# EasyEDA schematic SCH_Reserach-project_2025-06-22.json

## Sheets
1 Sheet_1: TITLE: Sheet_1; REV: 1.0; Date: 2025-05-27; Sheet: 1/1; Drawn By: nvasyliev; Company: Your Company
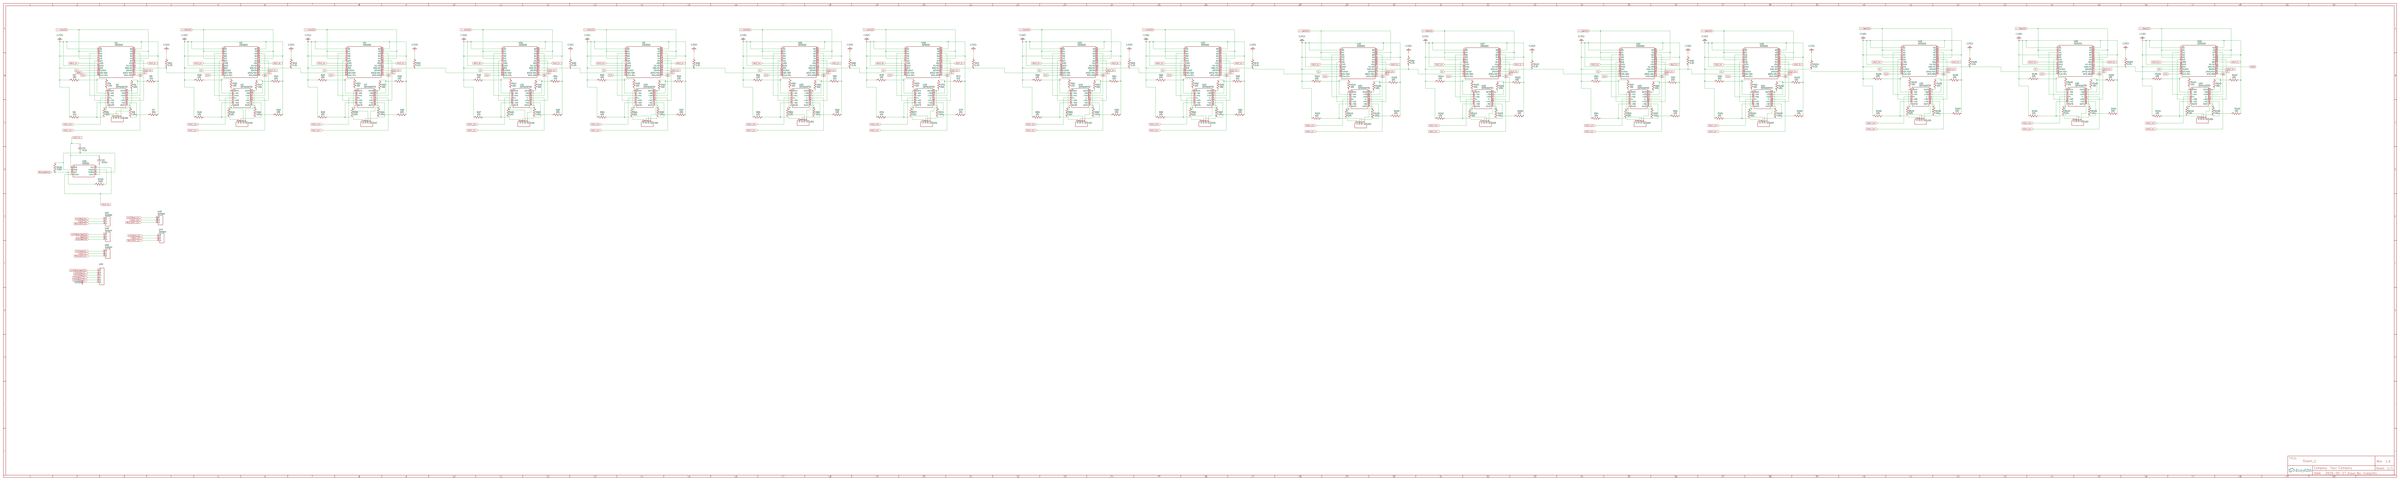
[diagram p0: Sheet_1]
2 Sheet_2: TITLE: Sheet_2; Date: 2025-05-30
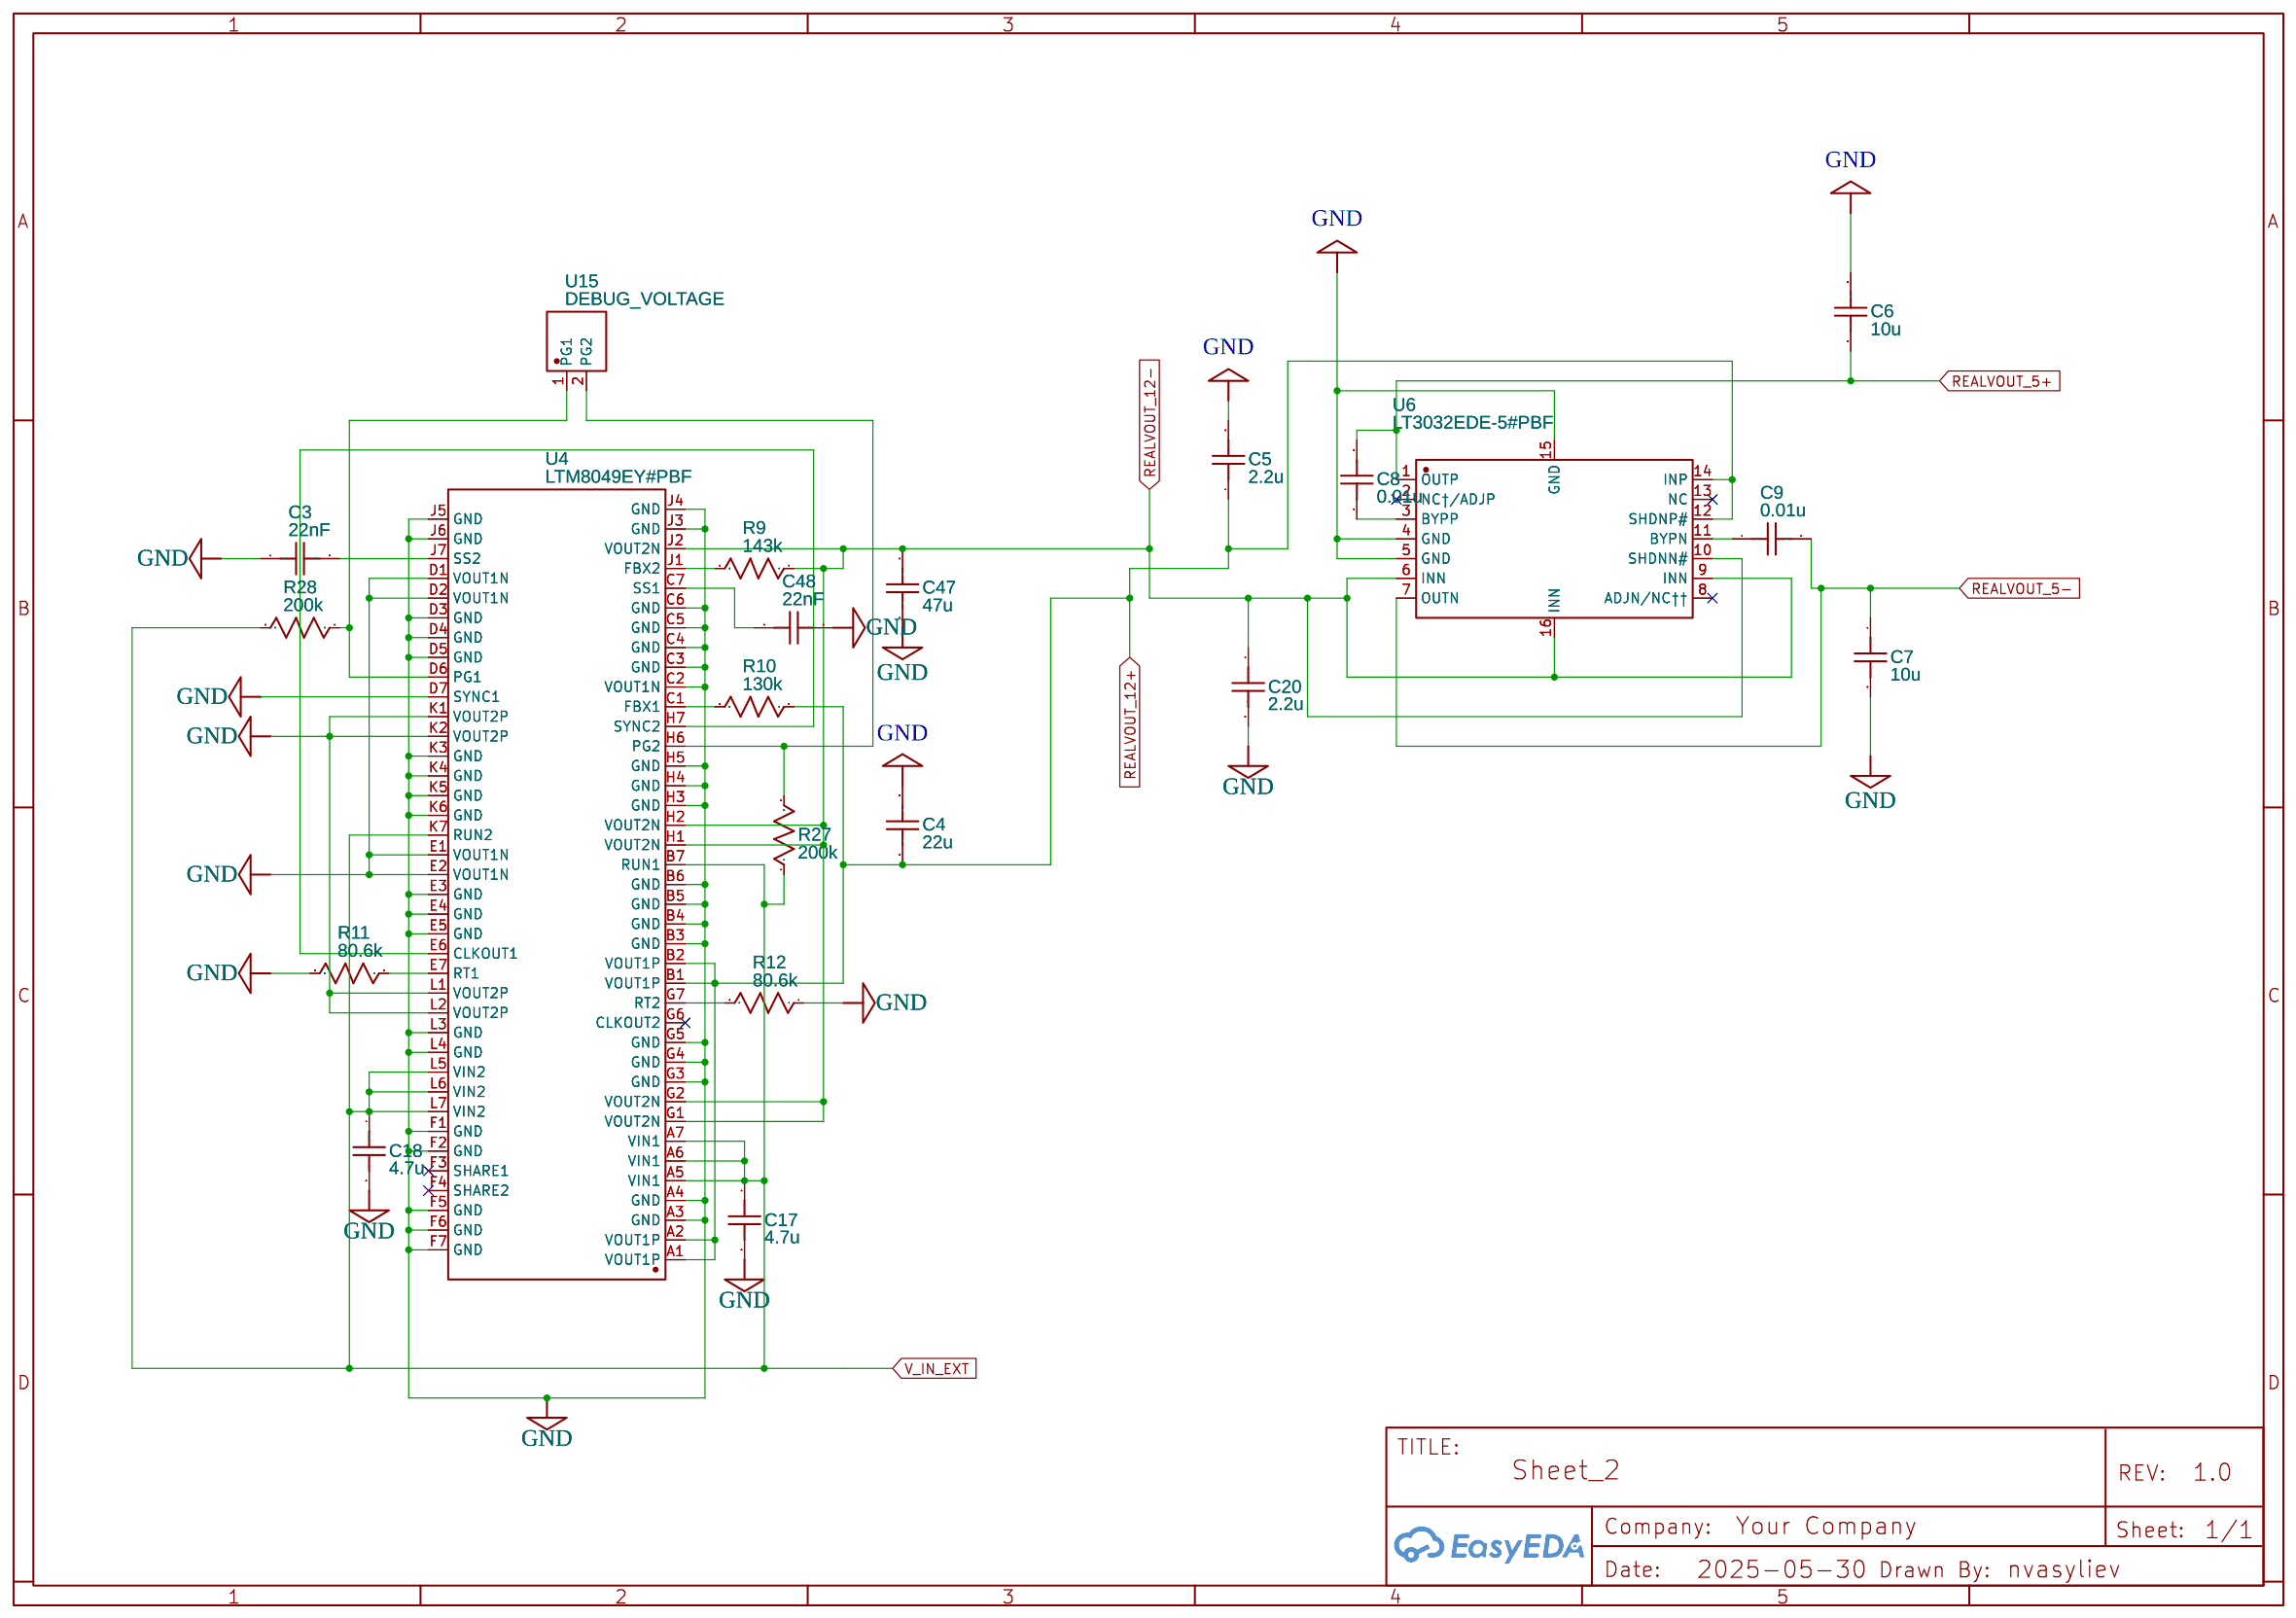
[diagram p1: Sheet_2]
3 Sheet_3: TITLE: Sheet_3; Date: 2025-05-30
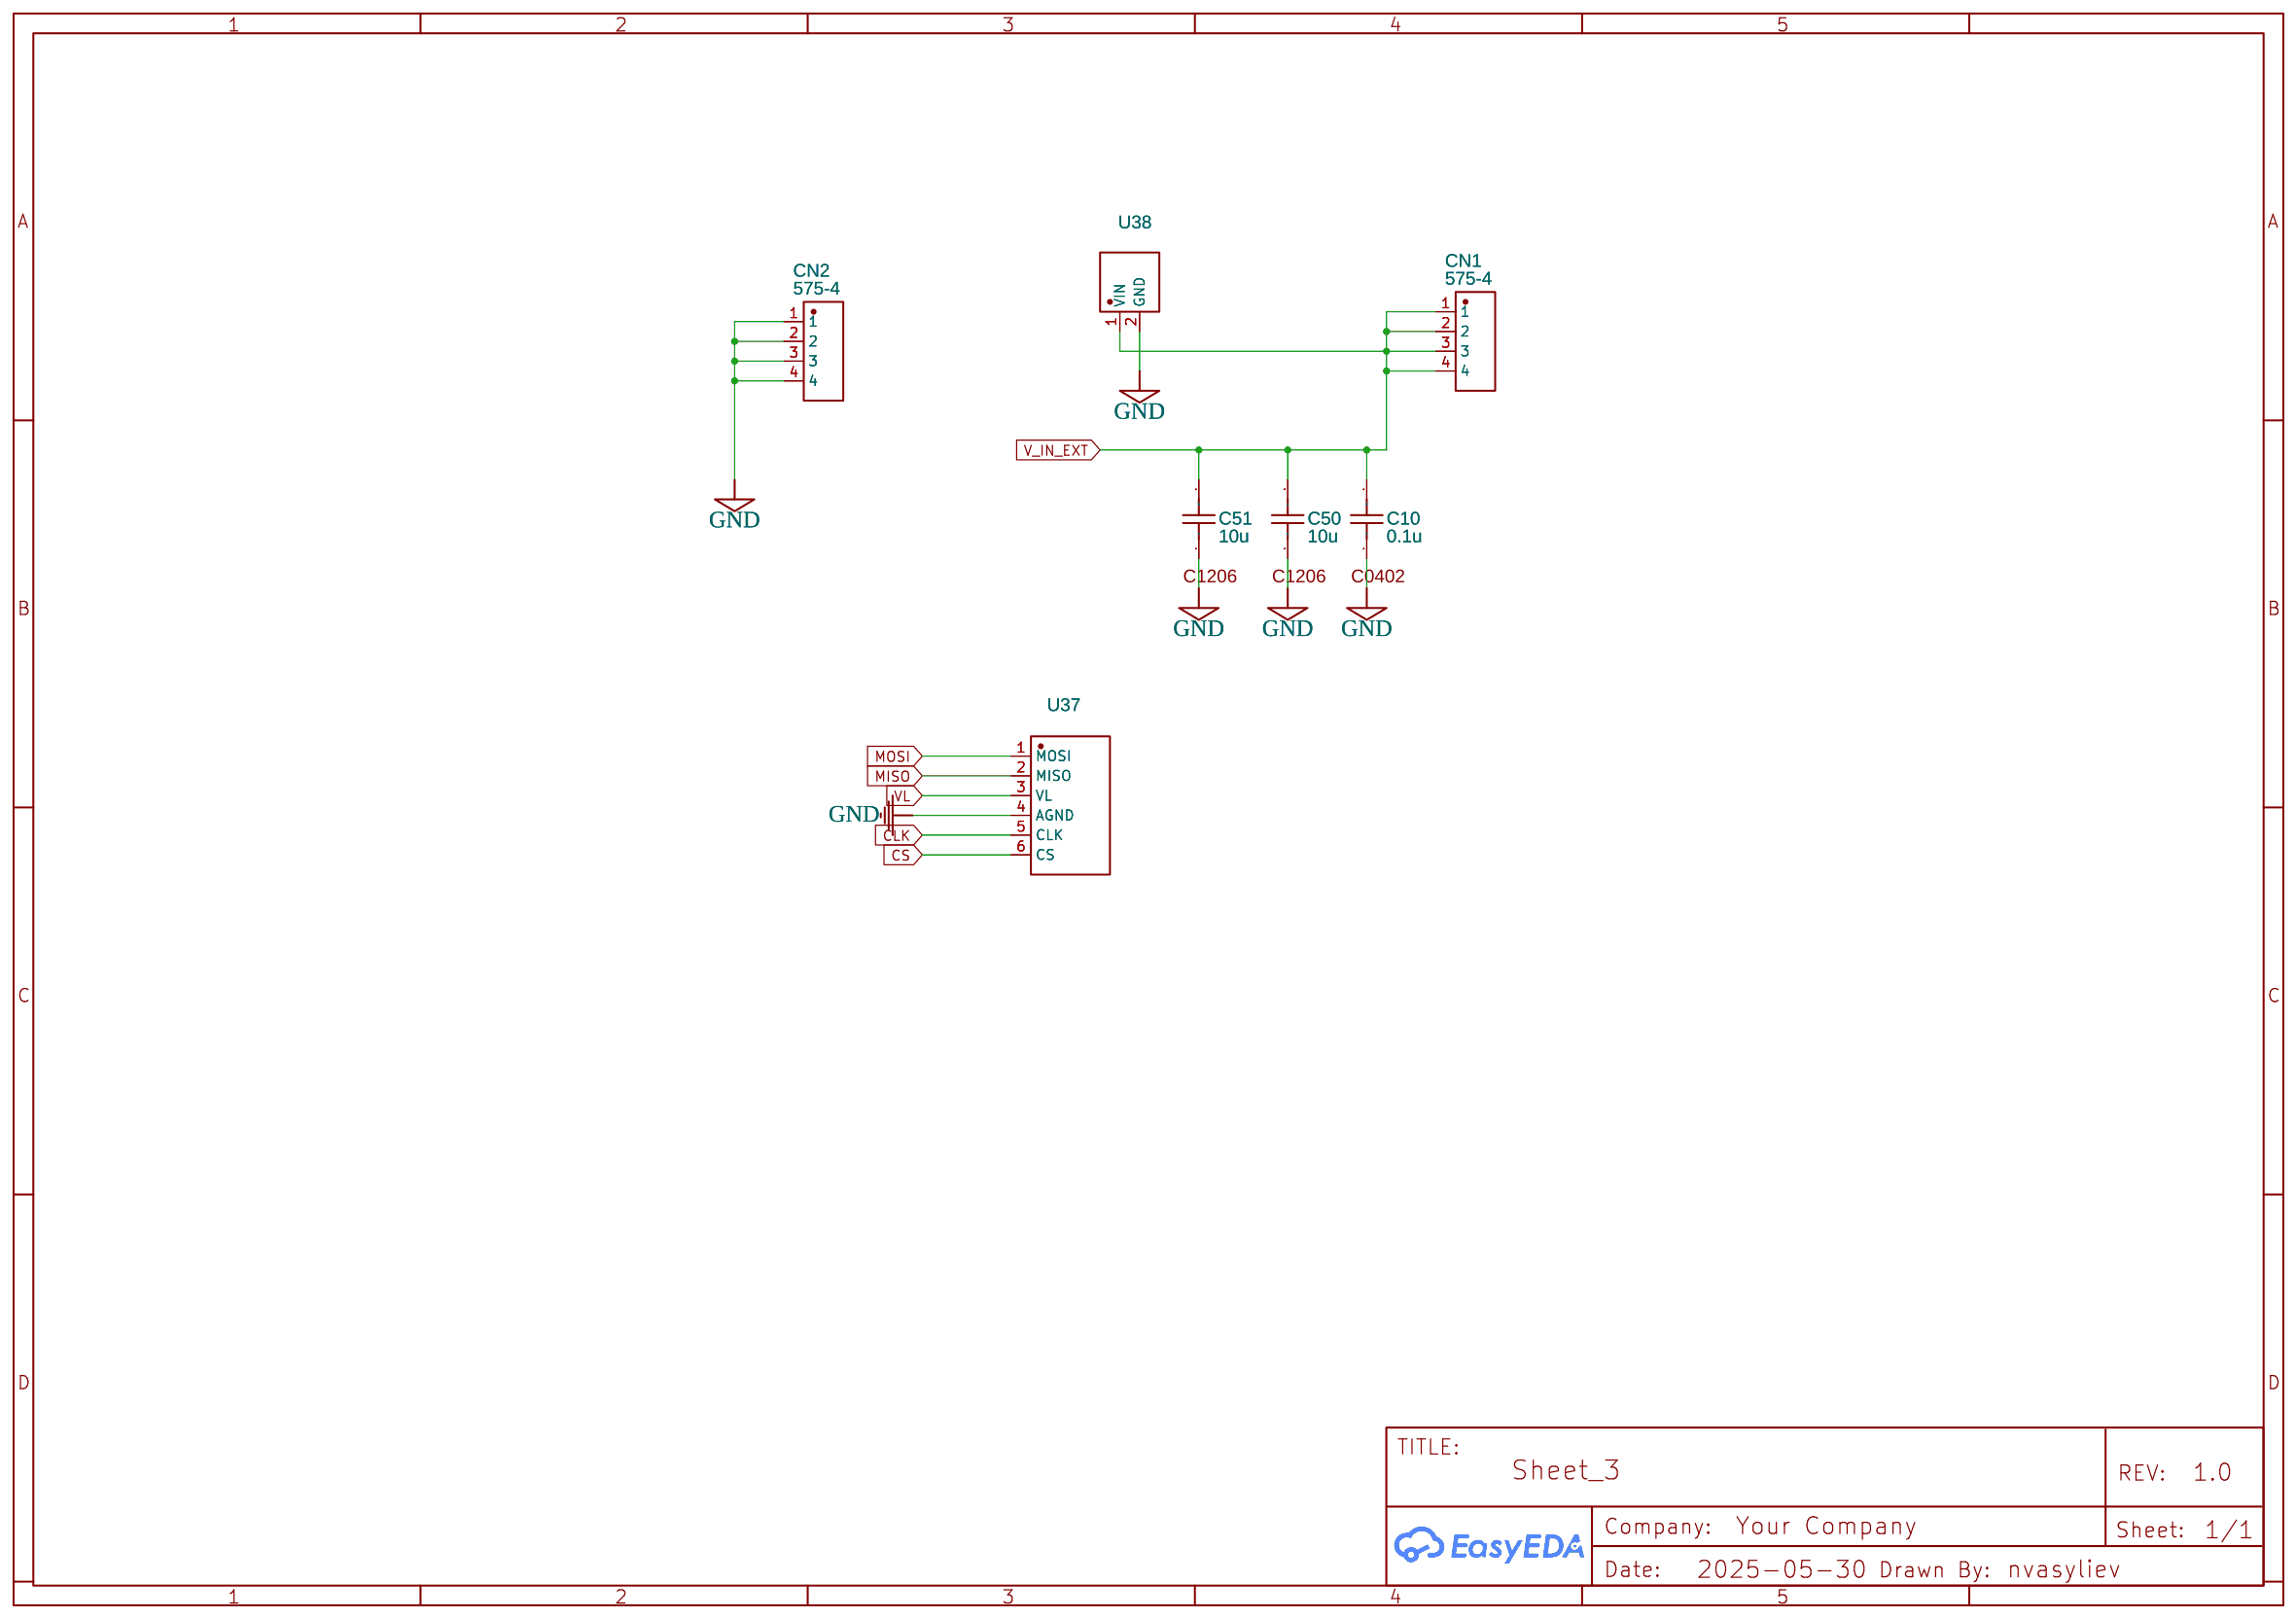
[diagram p2: Sheet_3]

## Parts
sheet Sheet_1
C1  0.1u  [C0603]
C2  0.01u  [C0603]
R1  10k  [R0603]
R2  10k  [R0603]
R3  10k  [R0603]
R4  10k  [R0603]
R5  10k  [R0603]
R6  10k  [R0603]
R7  10k  [R0603]
R8  10k  [R0603]
R13  2.2k  [R0603]
R14  10k  [R0603]
R15  10k  [R0603]
R16  10k  [R0603]
R17  10k  [R0603]
R18  10k  [R0603]
R19  10k  [R0603]
R20  10k  [R0603]
R21  2.2k  [R0603]
R22  10k  [R0603]
R23  10k  [R0603]
R24  10k  [R0603]
R25  10k  [R0603]
R26  2.2k  [R0603]
R29  10k  [R0603]
R30  10k  [R0603]
R31  10k  [R0603]
R32  10k  [R0603]
R33  10k  [R0603]
R34  2.2k  [R0603]
R35  2.2k  [R0603]
R36  10k  [R0603]
R37  10k  [R0603]
R38  10k  [R0603]
R39  10k  [R0603]
R40  10k  [R0603]
R41  10k  [R0603]
R42  10k  [R0603]
R43  10k  [R0603]
R44  10k  [R0603]
R45  10k  [R0603]
R46  10k  [R0603]
R47  10k  [R0603]
R48  10k  [R0603]
R49  10k  [R0603]
R50  10k  [R0603]
R51  10k  [R0603]
R52  2.2k  [R0603]
R53  2.2k  [R0603]
R54  10k  [R0603]
R55  10k  [R0603]
R56  10k  [R0603]
R57  10k  [R0603]
R58  10k  [R0603]
R59  10k  [R0603]
R60  10k  [R0603]
R61  10k  [R0603]
R62  10k  [R0603]
R63  10k  [R0603]
R64  10k  [R0603]
R65  10k  [R0603]
R66  10k  [R0603]
R67  10k  [R0603]
R68  10k  [R0603]
R69  10k  [R0603]
R70  2.2k  [R0603]
R71  2.2k  [R0603]
R72  10k  [R0603]
R73  10k  [R0603]
R74  10k  [R0603]
R75  10k  [R0603]
R76  10k  [R0603]
R77  10k  [R0603]
R78  10k  [R0603]
R79  10k  [R0603]
R80  10k  [R0603]
R81  10k  [R0603]
R82  10k  [R0603]
R83  10k  [R0603]
R84  10k  [R0603]
R85  10k  [R0603]
R86  10k  [R0603]
R87  10k  [R0603]
R88  2.2k  [R0603]
R89  2.2k  [R0603]
R90  10k  [R0603]
R91  10k  [R0603]
R92  10k  [R0603]
R93  10k  [R0603]
R94  10k  [R0603]
R95  10k  [R0603]
R96  10k  [R0603]
R97  10k  [R0603]
R98  10k  [R0603]
R99  10k  [R0603]
R100  10k  [R0603]
R101  10k  [R0603]
R102  10k  [R0603]
R103  10k  [R0603]
R104  10k  [R0603]
R105  10k  [R0603]
R106  2.2k  [R0603]
R107  2.2k  [R0603]
R108  10k  [R0603]
R109  10k  [R0603]
R110  10k  [R0603]
R111  10k  [R0603]
R112  10k  [R0603]
R113  10k  [R0603]
R114  10k  [R0603]
R115  10k  [R0603]
R116  10k  [R0603]
R117  10k  [R0603]
R118  10k  [R0603]
R119  10k  [R0603]
R120  10k  [R0603]
R121  10k  [R0603]
R122  10k  [R0603]
R123  10k  [R0603]
R125  10k  [R0603]
R126  10k  [R0603]
R127  10k  [R0603]
R128  10k  [R0603]
R129  7150  [R0603]
R130  7150  [R0603]
R131  10k  [R0603]
R132  10k  [R0603]
R133  10k  [R0603]
R134  10k  [R0603]
R135  2.2k  [R0603]
R137  10k  [R0603]
R138  10k  [R0603]
R139  10k  [R0603]
R140  10k  [R0603]
R141  10k  [R0603]
R142  10k  [R0603]
R143  10k  [R0603]
R144  10k  [R0603]
R145  10k  [R0603]
R146  10k  [R0603]
R147  10k  [R0603]
R148  10k  [R0603]
R149  10k  [R0603]
R150  10k  [R0603]
R151  10k  [R0603]
R152  10k  [R0603]
R153  2.2k  [R0603]
U1  AD5263  [TSSOP-24_L7.8-W4.4-P0.65-LS6.4-TL]
U2  OPA4197ID  [SOIC-14_L8.7-W3.9-P1.27-LS6.0-BL]
U3  AD5263  [TSSOP-24_L7.8-W4.4-P0.65-LS6.4-TL]
U5  OPA4197ID  [SOIC-14_L8.7-W3.9-P1.27-LS6.0-BL]
U7  OPA4197ID  [SOIC-14_L8.7-W3.9-P1.27-LS6.0-BL]
U8  AD5263  [TSSOP-24_L7.8-W4.4-P0.65-LS6.4-TL]
U9  AD5263  [TSSOP-24_L7.8-W4.4-P0.65-LS6.4-TL]
U10  OPA4197ID  [SOIC-14_L8.7-W3.9-P1.27-LS6.0-BL]
U11  OPA4197ID  [SOIC-14_L8.7-W3.9-P1.27-LS6.0-BL]
U12  AD5263  [TSSOP-24_L7.8-W4.4-P0.65-LS6.4-TL]
U13  AD5263  [TSSOP-24_L7.8-W4.4-P0.65-LS6.4-TL]
U14  OPA4197ID  [SOIC-14_L8.7-W3.9-P1.27-LS6.0-BL]
U16  OPA4197ID  [SOIC-14_L8.7-W3.9-P1.27-LS6.0-BL]
U17  AD5263  [TSSOP-24_L7.8-W4.4-P0.65-LS6.4-TL]
U18  AD5263  [TSSOP-24_L7.8-W4.4-P0.65-LS6.4-TL]
U19  OPA4197ID  [SOIC-14_L8.7-W3.9-P1.27-LS6.0-BL]
U20  OPA4197ID  [SOIC-14_L8.7-W3.9-P1.27-LS6.0-BL]
U21  AD5263  [TSSOP-24_L7.8-W4.4-P0.65-LS6.4-TL]
U22  AD5263  [TSSOP-24_L7.8-W4.4-P0.65-LS6.4-TL]
U23  OPA4197ID  [SOIC-14_L8.7-W3.9-P1.27-LS6.0-BL]
U24  OPA4197ID  [SOIC-14_L8.7-W3.9-P1.27-LS6.0-BL]
U25  NE555  [SOP-8_L5.0-W4.0-P1.27-LS6.0-BL]
U26  AD5263  [TSSOP-24_L7.8-W4.4-P0.65-LS6.4-TL]
U27  AD5263  [TSSOP-24_L7.8-W4.4-P0.65-LS6.4-TL]
U28  OPA4197ID  [SOIC-14_L8.7-W3.9-P1.27-LS6.0-BL]
U29  OPA4197ID  [SOIC-14_L8.7-W3.9-P1.27-LS6.0-BL]
U30  AD5263  [TSSOP-24_L7.8-W4.4-P0.65-LS6.4-TL]
U31  OPA4197ID  [SOIC-14_L8.7-W3.9-P1.27-LS6.0-BL]
U32  AD5263  [TSSOP-24_L7.8-W4.4-P0.65-LS6.4-TL]
U33  AD5263  [TSSOP-24_L7.8-W4.4-P0.65-LS6.4-TL]
U34  OPA4197ID  [SOIC-14_L8.7-W3.9-P1.27-LS6.0-BL]
U35  OPA4197ID  [SOIC-14_L8.7-W3.9-P1.27-LS6.0-BL]
U36  AD5263  [TSSOP-24_L7.8-W4.4-P0.65-LS6.4-TL]
U39  NO  [4-CONNECTOR]
U40  Jumper  [3-CONNECTOR]
U41  Jumper  [3-CONNECTOR]
U42  Jumper  [3-CONNECTOR]
U43  Jumper  [3-CONNECTOR]
U44  Jumper  [3-CONNECTOR]
U45  NO  [6-CONNECTOR]
U46  NO  [4-CONNECTOR]
U47  NO  [4-CONNECTOR]
U48  NO  [4-CONNECTOR]
U49  NO  [4-CONNECTOR]
U50  NO  [4-CONNECTOR]
U51  NO  [4-CONNECTOR]
U52  NO  [4-CONNECTOR]
U53  NO  [4-CONNECTOR]
U54  NO  [4-CONNECTOR]
U55  NO  [4-CONNECTOR]
U56  NO  [4-CONNECTOR]
U57  NO  [4-CONNECTOR]
U58  NO  [4-CONNECTOR]
U59  NO  [4-CONNECTOR]
U60  NO  [4-CONNECTOR]
sheet Sheet_2
C3  22nF  [C0603]
C4  22u  [C1210]
C5  2.2u  [C0805]
C6  10u  [C1206]
C7  10u  [C1206]
C8  0.01u  [C0402]
C9  0.01u  [C0402]
C17  4.7u  [C0603]
C18  4.7u  [C0603]
C20  2.2u  [C0805]
C47  47u  [C1210]
C48  22nF  [C0603]
R9  143k  [R0603]
R10  130k  [R0603]
R11  80.6k  [R0603]
R12  80.6k  [R0603]
R27  200k  [R0603]
R28  200k  [R0603]
U4  LTM8049EY#PBF  [BGA-77_L15.0-W9.0-R11-C7-P1.27-TL]
U6  LT3032EDE-5#PBF  [DFN-14_L4.0-W3.0-P0.50-BL-EP_LT3032XXX]
U15  DEBUG_VOLTAGE  [2-CONNECTOR]
sheet Sheet_3
C10  0.1u  [C0402]
C50  10u  [C1206]
C51  10u  [C1206]
CN1  575-4  [SMD_BD7.9-L7.9-W7.9-D5.2]
CN2  575-4  [SMD_BD7.9-L7.9-W7.9-D5.2]
U37  -  [6-CONNECTOR]
U38  -  [2-CONNECTOR]

## Library data of the parts
C1 C2 C6-C9 C17 C18 = C_0603_US: Contributor: LCEDA_Lib
R1-R123 R125-R135 R137-R153 = R_0603_US: Contributor: LCEDA_Lib
U1 U3 U8 U9 U12 U13 U17 U18 U21 U22 U26 U27 U30 U32 U33 U36 = AD5263BRUZ20: Contributor: LCSC; Supplier: LCSC; Supplier Part: C207963; Manufacturer: ADI(亚德诺); JLCPCB Part Class: Extended Part
U2 U5 U7 U10 U11 U14 U16 U19 U20 U23 U24 U28 U29 U31 U34 U35 = OPA4197ID: Contributor: LCSC; Supplier: LCSC; Supplier Part: C2872557; Manufacturer: TI(德州仪器); JLCPCB Part Class: Extended Part
U25 = NE555: Contributor: LCSC; Supplier: LCSC; Supplier Part: C504549; Manufacturer: null; JLCPCB Part Class: Extended Part
C3 C4 C47 C48 = C_1206_US: Contributor: LCEDA_Lib
C5 C20 = C_0603_US: Contributor: LCEDA_Lib; Package Display: No
U4 = LTM8049EY#PBF: Contributor: LCSC; Supplier: LCSC; Supplier Part: C690701; Manufacturer: ADI(亚德诺); JLCPCB Part Class: Extended Part
U6 = LT3032EDE-5#PBF: Contributor: LCSC; Supplier: LCSC; Supplier Part: C580007; Manufacturer: ADI(亚德诺); JLCPCB Part Class: Extended Part
U15 = DEBUG_VOLTAGE
C10 C50 C51 = C_0603_US: Contributor: LCEDA_Lib; Package Display: Yes
CN1 CN2 = 575-4: Supplier: LCSC; Supplier Part: C4944061; Manufacturer: Keystone; JLCPCB Part Class: Extended Part; Contributor: lcsc

## Nets
GND: C3.1 C4.2 C5.2 C6.2 C7.2 C10.1 C17.2 C18.2 C20.2 C47.1 C48.2 C50.1 C51.1 CN2.1 CN2.2 CN2.3 CN2.4 R2.1 R4.1 R7.2 R8.2 R11.2 R12.1 R13.2 R14.2 R15.2 R18.1 R20.1 R21.2 R24.1 R26.2 R29.1 R32.2 R33.2 R34.2 R35.2 R36.2 R37.2 R40.1 R42.1 R45.1 R47.1 R50.2 R51.2 R52.2 R53.2 R54.2 R55.2 R58.1 R60.1 R63.1 R65.1 R68.2 R69.2 R70.2 R71.2 R72.2 R73.2 R76.1 R78.1 R81.1 R83.1 R86.2 R87.2 R88.2 R89.2 R90.2 R91.2 R94.1 R96.1 R99.1 R101.1 R104.2 R105.2 R106.2 R107.2 R108.2 R109.2 R112.1 R114.1 R117.1 R119.1 R122.2 R123.2 R126.1 R128.1 R133.2 R134.2 R135.2 R137.2 R138.2 R141.1 R143.1 R146.1 R148.1 R151.2 R152.2 R153.2 U1.1(B1) U1.4(B3) U1.8(GND) U1.9(DIS) U1.21(B4) U1.24(B2) U3.1(B1) U3.4(B3) U3.8(GND) U3.9(DIS) U3.21(B4) U3.24(B2) U4.A3(GND) U4.A4(GND) U4.B3(GND) U4.B4(GND) U4.B5(GND) U4.B6(GND) U4.C2(VOUT1N) U4.C3(GND) U4.C4(GND) U4.C5(GND) U4.C6(GND) U4.D1(VOUT1N) U4.D2(VOUT1N) U4.D3(GND) U4.D4(GND) U4.D5(GND) U4.D7(SYNC1) U4.E1(VOUT1N) U4.E2(VOUT1N) U4.E3(GND) U4.E4(GND) U4.E5(GND) U4.F1(GND) U4.F2(GND) U4.F5(GND) U4.F6(GND) U4.F7(GND) U4.G3(GND) U4.G4(GND) U4.G5(GND) U4.H3(GND) U4.H4(GND) U4.H5(GND) U4.J3(GND) U4.J4(GND) U4.J5(GND) U4.J6(GND) U4.K1(VOUT2P) U4.K2(VOUT2P) U4.K3(GND) U4.K4(GND) U4.K5(GND) U4.K6(GND) U4.L1(VOUT2P) U4.L2(VOUT2P) U4.L3(GND) U4.L4(GND) U6.4(GND) U6.5(GND) U6.15(GND) U8.1(B1) U8.4(B3) U8.8(GND) U8.9(DIS) U8.21(B4) U8.24(B2) U9.1(B1) U9.4(B3) U9.8(GND) U9.9(DIS) U9.21(B4) U9.24(B2) U12.1(B1) U12.4(B3) U12.8(GND) U12.9(DIS) U12.21(B4) U12.24(B2) U13.1(B1) U13.4(B3) U13.8(GND) U13.9(DIS) U13.21(B4) U13.24(B2) U17.1(B1) U17.4(B3) U17.8(GND) U17.9(DIS) U17.21(B4) U17.24(B2) U18.1(B1) U18.4(B3) U18.8(GND) U18.9(DIS) U18.21(B4) U18.24(B2) U21.1(B1) U21.4(B3) U21.8(GND) U21.9(DIS) U21.21(B4) U21.24(B2) U22.1(B1) U22.4(B3) U22.8(GND) U22.9(DIS) U22.21(B4) U22.24(B2) U26.1(B1) U26.4(B3) U26.8(GND) U26.9(DIS) U26.21(B4) U26.24(B2) U27.1(B1) U27.4(B3) U27.8(GND) U27.9(DIS) U27.21(B4) U27.24(B2) U30.1(B1) U30.4(B3) U30.8(GND) U30.9(DIS) U30.21(B4) U30.24(B2) U32.1(B1) U32.4(B3) U32.8(GND) U32.9(DIS) U32.21(B4) U32.24(B2) U33.1(B1) U33.4(B3) U33.8(GND) U33.9(DIS) U33.21(B4) U33.24(B2) U36.1(B1) U36.4(B3) U36.8(GND) U36.9(DIS) U36.21(B4) U36.24(B2) U37.4(AGND) U38.2(GND) U45.6
+-5WAVES: U1.2(A1) U1.5(A3) U1.20(A4) U1.23(A2) U3.2(A1) U3.5(A3) U3.20(A4) U3.23(A2) U8.2(A1) U8.5(A3) U8.20(A4) U8.23(A2) U9.2(A1) U9.5(A3) U9.20(A4) U9.23(A2) U12.2(A1) U12.5(A3) U12.20(A4) U12.23(A2) U13.2(A1) U13.5(A3) U13.20(A4) U13.23(A2) U17.2(A1) U17.5(A3) U17.20(A4) U17.23(A2) U18.2(A1) U18.5(A3) U18.20(A4) U18.23(A2) U21.2(A1) U21.5(A3) U21.20(A4) U21.23(A2) U22.2(A1) U22.5(A3) U22.20(A4) U22.23(A2) U26.2(A1) U26.5(A3) U26.20(A4) U26.23(A2) U27.2(A1) U27.5(A3) U27.20(A4) U27.23(A2) U30.2(A1) U30.5(A3) U30.20(A4) U30.23(A2) U32.2(A1) U32.5(A3) U32.20(A4) U32.23(A2) U33.2(A1) U33.5(A3) U33.20(A4) U33.23(A2) U36.2(A1) U36.5(A3) U36.20(A4) U36.23(A2) U40.2
CLK: U1.12(CLK/SCL) U3.12(CLK/SCL) U8.12(CLK/SCL) U9.12(CLK/SCL) U12.12(CLK/SCL) U13.12(CLK/SCL) U17.12(CLK/SCL) U18.12(CLK/SCL) U21.12(CLK/SCL) U22.12(CLK/SCL) U26.12(CLK/SCL) U27.12(CLK/SCL) U30.12(CLK/SCL) U32.12(CLK/SCL) U33.12(CLK/SCL) U36.12(CLK/SCL) U37.5(CLK)
CS: U1.13(#CS/AD0) U3.13(#CS/AD0) U8.13(#CS/AD0) U9.13(#CS/AD0) U12.13(#CS/AD0) U13.13(#CS/AD0) U17.13(#CS/AD0) U18.13(#CS/AD0) U21.13(#CS/AD0) U22.13(#CS/AD0) U26.13(#CS/AD0) U27.13(#CS/AD0) U30.13(#CS/AD0) U32.13(#CS/AD0) U33.13(#CS/AD0) U36.13(#CS/AD0) U37.6(CS)
EXTERNAL5+: U41.1 U45.3
EXTERNAL5-: U42.1 U45.2
EXTERNAL5WAVES: U40.1 U45.1
EXTERNAL12+: U43.1 U45.5
EXTERNAL12-: U44.1 U45.4
MISO: U33.16(SDO/O1) U37.2(MISO)
MOSI: U1.11(SDI/SDA) U37.1(MOSI)
REAL5WAVES: R129.1 R130.1 U25.3(OUT) U40.3
REALVOUT_5+: C6.1 C8.2 U6.1(OUTP) U41.3
REALVOUT_5-: C7.1 C9.2 U6.7(OUTN) U42.3
REALVOUT_12+: C4.1 C5.1 R10.1 U4.A1(VOUT1P) U4.A2(VOUT1P) U4.B1(VOUT1P) U4.B2(VOUT1P) U6.12(SHDNP#) U6.14(INP) U43.3
REALVOUT_12-: C20.1 C47.2 R9.1 U4.G1(VOUT2N) U4.G2(VOUT2N) U4.H1(VOUT2N) U4.H2(VOUT2N) U4.J2(VOUT2N) U6.6(INN) U6.9(INN) U6.10(SHDNN#) U6.16(INN) U44.3
V_IN_EXT: C10.2 C17.1 C18.1 C50.2 C51.2 CN1.1 CN1.2 CN1.3 CN1.4 R27.1 R28.2 U4.A5(VIN1) U4.A6(VIN1) U4.A7(VIN1) U4.B7(RUN1) U4.K7(RUN2) U4.L5(VIN2) U4.L6(VIN2) U4.L7(VIN2) U38.1(VIN)
VL: U1.10(VLOGIC) U1.14(#RES/AD1) U3.10(VLOGIC) U3.14(#RES/AD1) U8.10(VLOGIC) U8.14(#RES/AD1) U9.10(VLOGIC) U9.14(#RES/AD1) U12.10(VLOGIC) U12.14(#RES/AD1) U13.10(VLOGIC) U13.14(#RES/AD1) U17.10(VLOGIC) U17.14(#RES/AD1) U18.10(VLOGIC) U18.14(#RES/AD1) U21.10(VLOGIC) U21.14(#RES/AD1) U22.10(VLOGIC) U22.14(#RES/AD1) U26.10(VLOGIC) U26.14(#RES/AD1) U27.10(VLOGIC) U27.14(#RES/AD1) U30.10(VLOGIC) U30.14(#RES/AD1) U32.10(VLOGIC) U32.14(#RES/AD1) U33.10(VLOGIC) U33.14(#RES/AD1) U36.10(VLOGIC) U36.14(#RES/AD1) U37.3(VL)
VOUT_5+: U1.7(VDD) U1.15(#SHDN) U3.7(VDD) U3.15(#SHDN) U8.7(VDD) U8.15(#SHDN) U9.7(VDD) U9.15(#SHDN) U12.7(VDD) U12.15(#SHDN) U13.7(VDD) U13.15(#SHDN) U17.7(VDD) U17.15(#SHDN) U18.7(VDD) U18.15(#SHDN) U21.7(VDD) U21.15(#SHDN) U22.7(VDD) U22.15(#SHDN) U25.4(RESET) U25.8(VCC) U26.7(VDD) U26.15(#SHDN) U27.7(VDD) U27.15(#SHDN) U30.7(VDD) U30.15(#SHDN) U32.7(VDD) U32.15(#SHDN) U33.7(VDD) U33.15(#SHDN) U36.7(VDD) U36.15(#SHDN) U41.2
VOUT_5-: C1.2 C2.2 U1.18(VSS) U3.18(VSS) U8.18(VSS) U9.18(VSS) U12.18(VSS) U13.18(VSS) U17.18(VSS) U18.18(VSS) U21.18(VSS) U22.18(VSS) U25.1(GND) U26.18(VSS) U27.18(VSS) U30.18(VSS) U32.18(VSS) U33.18(VSS) U36.18(VSS) U42.2
VOUT_12+: U2.4(V+) U5.4(V+) U7.4(V+) U10.4(V+) U11.4(V+) U14.4(V+) U16.4(V+) U19.4(V+) U20.4(V+) U23.4(V+) U24.4(V+) U28.4(V+) U29.4(V+) U31.4(V+) U34.4(V+) U35.4(V+) U43.2
VOUT_12-: U2.11(V-) U5.11(V-) U7.11(V-) U10.11(V-) U11.11(V-) U14.11(V-) U16.11(V-) U19.11(V-) U20.11(V-) U23.11(V-) U24.11(V-) U28.11(V-) U29.11(V-) U31.11(V-) U34.11(V-) U35.11(V-) U44.2
Net-(C1-1): C1.1 R130.2 U25.2(TRIG) U25.6(THRES)
Net-(C2-1): C2.1 U25.5(CONT)
Net-(C3-2): C3.2 U4.J7(SS2)
Net-(C8-1): C8.1 U6.3(BYPP)
Net-(C9-1): C9.1 U6.11(BYPN)
Net-(C48-1): C48.1 U4.C7(SS1)
Net-(R1-1): R1.1 U2.1(OUTA) U39.4
Net-(R1-2): R1.2 R2.2 U2.2(-INA)
Net-(R3-1): R3.1 R4.2 U2.6(-INB)
Net-(R3-2): R3.2 U2.7(OUTB) U39.2
Net-(R5-1): R5.1 U2.14(OUTD) U39.3
Net-(R5-2): R5.2 R8.1 U2.13(-IND)
Net-(R6-1): R6.1 R7.1 U2.9(-INC)
Net-(R6-2): R6.2 U2.8(OUTC) U39.1
Net-(R9-2): R9.2 U4.J1(FBX2)
Net-(R10-2): R10.2 U4.C1(FBX1)
Net-(R11-1): R11.1 U4.E7(RT1)
Net-(R12-2): R12.2 U4.G7(RT2)
Net-(R13-1): R13.1 U3.16(SDO/O1) U8.11(SDI/SDA)
Net-(R14-1): R14.1 R17.2 U5.13(-IND)
Net-(R15-1): R15.1 R16.1 U5.9(-INC)
Net-(R16-2): R16.2 U5.8(OUTC) U46.1
Net-(R17-1): R17.1 U5.14(OUTD) U46.3
Net-(R18-2): R18.2 R19.1 U5.6(-INB)
Net-(R19-2): R19.2 U5.7(OUTB) U46.2
Net-(R20-2): R20.2 R22.2 U5.2(-INA)
Net-(R21-1): R21.1 U1.16(SDO/O1) U3.11(SDI/SDA)
Net-(R22-1): R22.1 U5.1(OUTA) U46.4
Net-(R23-1): R23.1 U7.1(OUTA) U47.4
Net-(R23-2): R23.2 R24.2 U7.2(-INA)
Net-(R25-1): R25.1 R29.2 U7.6(-INB)
Net-(R25-2): R25.2 U7.7(OUTB) U47.2
Net-(R26-1): R26.1 U22.16(SDO/O1) U26.11(SDI/SDA)
Net-(R27-2): R27.2 U4.H6(PG2) U15.2(PG2)
Net-(R28-1): R28.1 U4.D6(PG1) U15.1(PG1)
Net-(R30-1): R30.1 U7.14(OUTD) U47.3
Net-(R30-2): R30.2 R33.1 U7.13(-IND)
Net-(R31-1): R31.1 R32.1 U7.9(-INC)
Net-(R31-2): R31.2 U7.8(OUTC) U47.1
Net-(R34-1): R34.1 U8.16(SDO/O1) U12.11(SDI/SDA)
Net-(R35-1): R35.1 U9.16(SDO/O1) U21.11(SDI/SDA)
Net-(R36-1): R36.1 R39.2 U10.13(-IND)
Net-(R37-1): R37.1 R38.1 U10.9(-INC)
Net-(R38-2): R38.2 U10.8(OUTC) U49.1
Net-(R39-1): R39.1 U10.14(OUTD) U49.3
Net-(R40-2): R40.2 R41.1 U10.6(-INB)
Net-(R41-2): R41.2 U10.7(OUTB) U49.2
Net-(R42-2): R42.2 R43.2 U10.2(-INA)
Net-(R43-1): R43.1 U10.1(OUTA) U49.4
Net-(R44-1): R44.1 U11.1(OUTA) U48.4
Net-(R44-2): R44.2 R45.2 U11.2(-INA)
Net-(R46-1): R46.1 R47.2 U11.6(-INB)
Net-(R46-2): R46.2 U11.7(OUTB) U48.2
Net-(R48-1): R48.1 U11.14(OUTD) U48.3
Net-(R48-2): R48.2 R51.1 U11.13(-IND)
Net-(R49-1): R49.1 R50.1 U11.9(-INC)
Net-(R49-2): R49.2 U11.8(OUTC) U48.1
Net-(R52-1): R52.1 U9.11(SDI/SDA) U12.16(SDO/O1)
Net-(R53-1): R53.1 U13.16(SDO/O1) U17.11(SDI/SDA)
Net-(R54-1): R54.1 R57.2 U14.13(-IND)
Net-(R55-1): R55.1 R56.1 U14.9(-INC)
Net-(R56-2): R56.2 U14.8(OUTC) U52.1
Net-(R57-1): R57.1 U14.14(OUTD) U52.3
Net-(R58-2): R58.2 R59.1 U14.6(-INB)
Net-(R59-2): R59.2 U14.7(OUTB) U52.2
Net-(R60-2): R60.2 R61.2 U14.2(-INA)
Net-(R61-1): R61.1 U14.1(OUTA) U52.4
Net-(R62-1): R62.1 U16.1(OUTA) U53.4
Net-(R62-2): R62.2 R63.2 U16.2(-INA)
Net-(R64-1): R64.1 R65.2 U16.6(-INB)
Net-(R64-2): R64.2 U16.7(OUTB) U53.2
Net-(R66-1): R66.1 U16.14(OUTD) U53.3
Net-(R66-2): R66.2 R69.1 U16.13(-IND)
Net-(R67-1): R67.1 R68.1 U16.9(-INC)
Net-(R67-2): R67.2 U16.8(OUTC) U53.1
Net-(R70-1): R70.1 U17.16(SDO/O1) U30.11(SDI/SDA)
Net-(R71-1): R71.1 U13.11(SDI/SDA) U18.16(SDO/O1)
Net-(R72-1): R72.1 R75.2 U19.13(-IND)
Net-(R73-1): R73.1 R74.1 U19.9(-INC)
Net-(R74-2): R74.2 U19.8(OUTC) U51.1
Net-(R75-1): R75.1 U19.14(OUTD) U51.3
Net-(R76-2): R76.2 R77.1 U19.6(-INB)
Net-(R77-2): R77.2 U19.7(OUTB) U51.2
Net-(R78-2): R78.2 R79.2 U19.2(-INA)
Net-(R79-1): R79.1 U19.1(OUTA) U51.4
Net-(R80-1): R80.1 U20.1(OUTA) U50.4
Net-(R80-2): R80.2 R81.2 U20.2(-INA)
Net-(R82-1): R82.1 R83.2 U20.6(-INB)
Net-(R82-2): R82.2 U20.7(OUTB) U50.2
Net-(R84-1): R84.1 U20.14(OUTD) U50.3
Net-(R84-2): R84.2 R87.1 U20.13(-IND)
Net-(R85-1): R85.1 R86.1 U20.9(-INC)
Net-(R85-2): R85.2 U20.8(OUTC) U50.1
Net-(R88-1): R88.1 U18.11(SDI/SDA) U21.16(SDO/O1)
Net-(R89-1): R89.1 U27.11(SDI/SDA) U30.16(SDO/O1)
Net-(R90-1): R90.1 R93.2 U23.13(-IND)
Net-(R91-1): R91.1 R92.1 U23.9(-INC)
Net-(R92-2): R92.2 U23.8(OUTC) U56.1
Net-(R93-1): R93.1 U23.14(OUTD) U56.3
Net-(R94-2): R94.2 R95.1 U23.6(-INB)
Net-(R95-2): R95.2 U23.7(OUTB) U56.2
Net-(R96-2): R96.2 R97.2 U23.2(-INA)
Net-(R97-1): R97.1 U23.1(OUTA) U56.4
Net-(R98-1): R98.1 U24.1(OUTA) U57.4
Net-(R98-2): R98.2 R99.2 U24.2(-INA)
Net-(R100-1): R100.1 R101.2 U24.6(-INB)
Net-(R100-2): R100.2 U24.7(OUTB) U57.2
Net-(R102-1): R102.1 U24.14(OUTD) U57.3
Net-(R102-2): R102.2 R105.1 U24.13(-IND)
Net-(R103-1): R103.1 R104.1 U24.9(-INC)
Net-(R103-2): R103.2 U24.8(OUTC) U57.1
Net-(R106-1): R106.1 U26.16(SDO/O1) U32.11(SDI/SDA)
Net-(R107-1): R107.1 U22.11(SDI/SDA) U27.16(SDO/O1)
Net-(R108-1): R108.1 R111.2 U28.13(-IND)
Net-(R109-1): R109.1 R110.1 U28.9(-INC)
Net-(R110-2): R110.2 U28.8(OUTC) U55.1
Net-(R111-1): R111.1 U28.14(OUTD) U55.3
Net-(R112-2): R112.2 R113.1 U28.6(-INB)
Net-(R113-2): R113.2 U28.7(OUTB) U55.2
Net-(R114-2): R114.2 R115.2 U28.2(-INA)
Net-(R115-1): R115.1 U28.1(OUTA) U55.4
Net-(R116-1): R116.1 U29.1(OUTA) U54.4
Net-(R116-2): R116.2 R117.2 U29.2(-INA)
Net-(R118-1): R118.1 R119.2 U29.6(-INB)
Net-(R118-2): R118.2 U29.7(OUTB) U54.2
Net-(R120-1): R120.1 U29.14(OUTD) U54.3
Net-(R120-2): R120.2 R123.1 U29.13(-IND)
Net-(R121-1): R121.1 R122.1 U29.9(-INC)
Net-(R121-2): R121.2 U29.8(OUTC) U54.1
Net-(R125-1): R125.1 U31.1(OUTA) U58.4
Net-(R125-2): R125.2 R126.2 U31.2(-INA)
Net-(R127-1): R127.1 R128.2 U31.6(-INB)
Net-(R127-2): R127.2 U31.7(OUTB) U58.2
Net-(R129-2): R129.2 U25.7(DISCH)
Net-(R131-1): R131.1 U31.14(OUTD) U58.3
Net-(R131-2): R131.2 R134.1 U31.13(-IND)
Net-(R132-1): R132.1 R133.1 U31.9(-INC)
Net-(R132-2): R132.2 U31.8(OUTC) U58.1
Net-(R135-1): R135.1 U32.16(SDO/O1) U36.11(SDI/SDA)
Net-(R137-1): R137.1 R140.2 U34.13(-IND)
Net-(R138-1): R138.1 R139.1 U34.9(-INC)
Net-(R139-2): R139.2 U34.8(OUTC) U60.1
Net-(R140-1): R140.1 U34.14(OUTD) U60.3
Net-(R141-2): R141.2 R142.1 U34.6(-INB)
Net-(R142-2): R142.2 U34.7(OUTB) U60.2
Net-(R143-2): R143.2 R144.2 U34.2(-INA)
Net-(R144-1): R144.1 U34.1(OUTA) U60.4
Net-(R145-1): R145.1 U35.1(OUTA) U59.4
Net-(R145-2): R145.2 R146.2 U35.2(-INA)
Net-(R147-1): R147.1 R148.2 U35.6(-INB)
Net-(R147-2): R147.2 U35.7(OUTB) U59.2
Net-(R149-1): R149.1 U35.14(OUTD) U59.3
Net-(R149-2): R149.2 R152.1 U35.13(-IND)
Net-(R150-1): R150.1 R151.1 U35.9(-INC)
Net-(R150-2): R150.2 U35.8(OUTC) U59.1
Net-(R153-1): R153.1 U33.11(SDI/SDA) U36.16(SDO/O1)
Net-(U1-3): U1.3(W1) U2.3(+INA)
Net-(U1-6): U1.6(W3) U2.5(+INB)
Net-(U1-19): U1.19(W4) U2.10(+INC)
Net-(U1-22): U1.22(W2) U2.12(+IND)
Net-(U3-3): U3.3(W1) U5.3(+INA)
Net-(U3-6): U3.6(W3) U5.5(+INB)
Net-(U3-19): U3.19(W4) U5.10(+INC)
Net-(U3-22): U3.22(W2) U5.12(+IND)
Net-(U4-E6): U4.E6(CLKOUT1) U4.H7(SYNC2)
Net-(U7-3): U7.3(+INA) U8.3(W1)
Net-(U7-5): U7.5(+INB) U8.6(W3)
Net-(U7-10): U7.10(+INC) U8.19(W4)
Net-(U7-12): U7.12(+IND) U8.22(W2)
Net-(U9-3): U9.3(W1) U10.3(+INA)
Net-(U9-6): U9.6(W3) U10.5(+INB)
Net-(U9-19): U9.19(W4) U10.10(+INC)
Net-(U9-22): U9.22(W2) U10.12(+IND)
Net-(U11-3): U11.3(+INA) U12.3(W1)
Net-(U11-5): U11.5(+INB) U12.6(W3)
Net-(U11-10): U11.10(+INC) U12.19(W4)
Net-(U11-12): U11.12(+IND) U12.22(W2)
Net-(U13-3): U13.3(W1) U14.3(+INA)
Net-(U13-6): U13.6(W3) U14.5(+INB)
Net-(U13-19): U13.19(W4) U14.10(+INC)
Net-(U13-22): U13.22(W2) U14.12(+IND)
Net-(U16-3): U16.3(+INA) U17.3(W1)
Net-(U16-5): U16.5(+INB) U17.6(W3)
Net-(U16-10): U16.10(+INC) U17.19(W4)
Net-(U16-12): U16.12(+IND) U17.22(W2)
Net-(U18-3): U18.3(W1) U19.3(+INA)
Net-(U18-6): U18.6(W3) U19.5(+INB)
Net-(U18-19): U18.19(W4) U19.10(+INC)
Net-(U18-22): U18.22(W2) U19.12(+IND)
Net-(U20-3): U20.3(+INA) U21.3(W1)
Net-(U20-5): U20.5(+INB) U21.6(W3)
Net-(U20-10): U20.10(+INC) U21.19(W4)
Net-(U20-12): U20.12(+IND) U21.22(W2)
Net-(U22-3): U22.3(W1) U23.3(+INA)
Net-(U22-6): U22.6(W3) U23.5(+INB)
Net-(U22-19): U22.19(W4) U23.10(+INC)
Net-(U22-22): U22.22(W2) U23.12(+IND)
Net-(U24-3): U24.3(+INA) U26.3(W1)
Net-(U24-5): U24.5(+INB) U26.6(W3)
Net-(U24-10): U24.10(+INC) U26.19(W4)
Net-(U24-12): U24.12(+IND) U26.22(W2)
Net-(U27-3): U27.3(W1) U28.3(+INA)
Net-(U27-6): U27.6(W3) U28.5(+INB)
Net-(U27-19): U27.19(W4) U28.10(+INC)
Net-(U27-22): U27.22(W2) U28.12(+IND)
Net-(U29-3): U29.3(+INA) U30.3(W1)
Net-(U29-5): U29.5(+INB) U30.6(W3)
Net-(U29-10): U29.10(+INC) U30.19(W4)
Net-(U29-12): U29.12(+IND) U30.22(W2)
Net-(U31-3): U31.3(+INA) U32.3(W1)
Net-(U31-5): U31.5(+INB) U32.6(W3)
Net-(U31-10): U31.10(+INC) U32.19(W4)
Net-(U31-12): U31.12(+IND) U32.22(W2)
Net-(U33-3): U33.3(W1) U34.3(+INA)
Net-(U33-6): U33.6(W3) U34.5(+INB)
Net-(U33-19): U33.19(W4) U34.10(+INC)
Net-(U33-22): U33.22(W2) U34.12(+IND)
Net-(U35-3): U35.3(+INA) U36.3(W1)
Net-(U35-5): U35.5(+INB) U36.6(W3)
Net-(U35-10): U35.10(+INC) U36.19(W4)
Net-(U35-12): U35.12(+IND) U36.22(W2)

Not connected (* = marked no-connect by the designer): U1 17(NC/O2)*; U3 17(NC/O2)*; U4 F3(SHARE1)* F4(SHARE2)* G6(CLKOUT2)*; U6 2(NC†/ADJP)* 8(ADJN/NC††)* 13(NC)*; U8 17(NC/O2)*; U9 17(NC/O2)*; U12 17(NC/O2)*; U13 17(NC/O2)*; U17 17(NC/O2)*; U18 17(NC/O2)*; U21 17(NC/O2)*; U22 17(NC/O2)*; U26 17(NC/O2)*; U27 17(NC/O2)*; U30 17(NC/O2)*; U32 17(NC/O2)*; U33 17(NC/O2)*; U36 17(NC/O2)*
